# EasyEDA Pro project ProPrj_电容计量V2_2026-06-24.epro, schematic Schematic2_4
Board Name: Board2; Create Date: 2025-10-20; Page Name: P1; Project Name: 电容计量; Schematic Name: Schematic2; Update Date: 2025-11-02; Page Size: A4; Version: V1.0
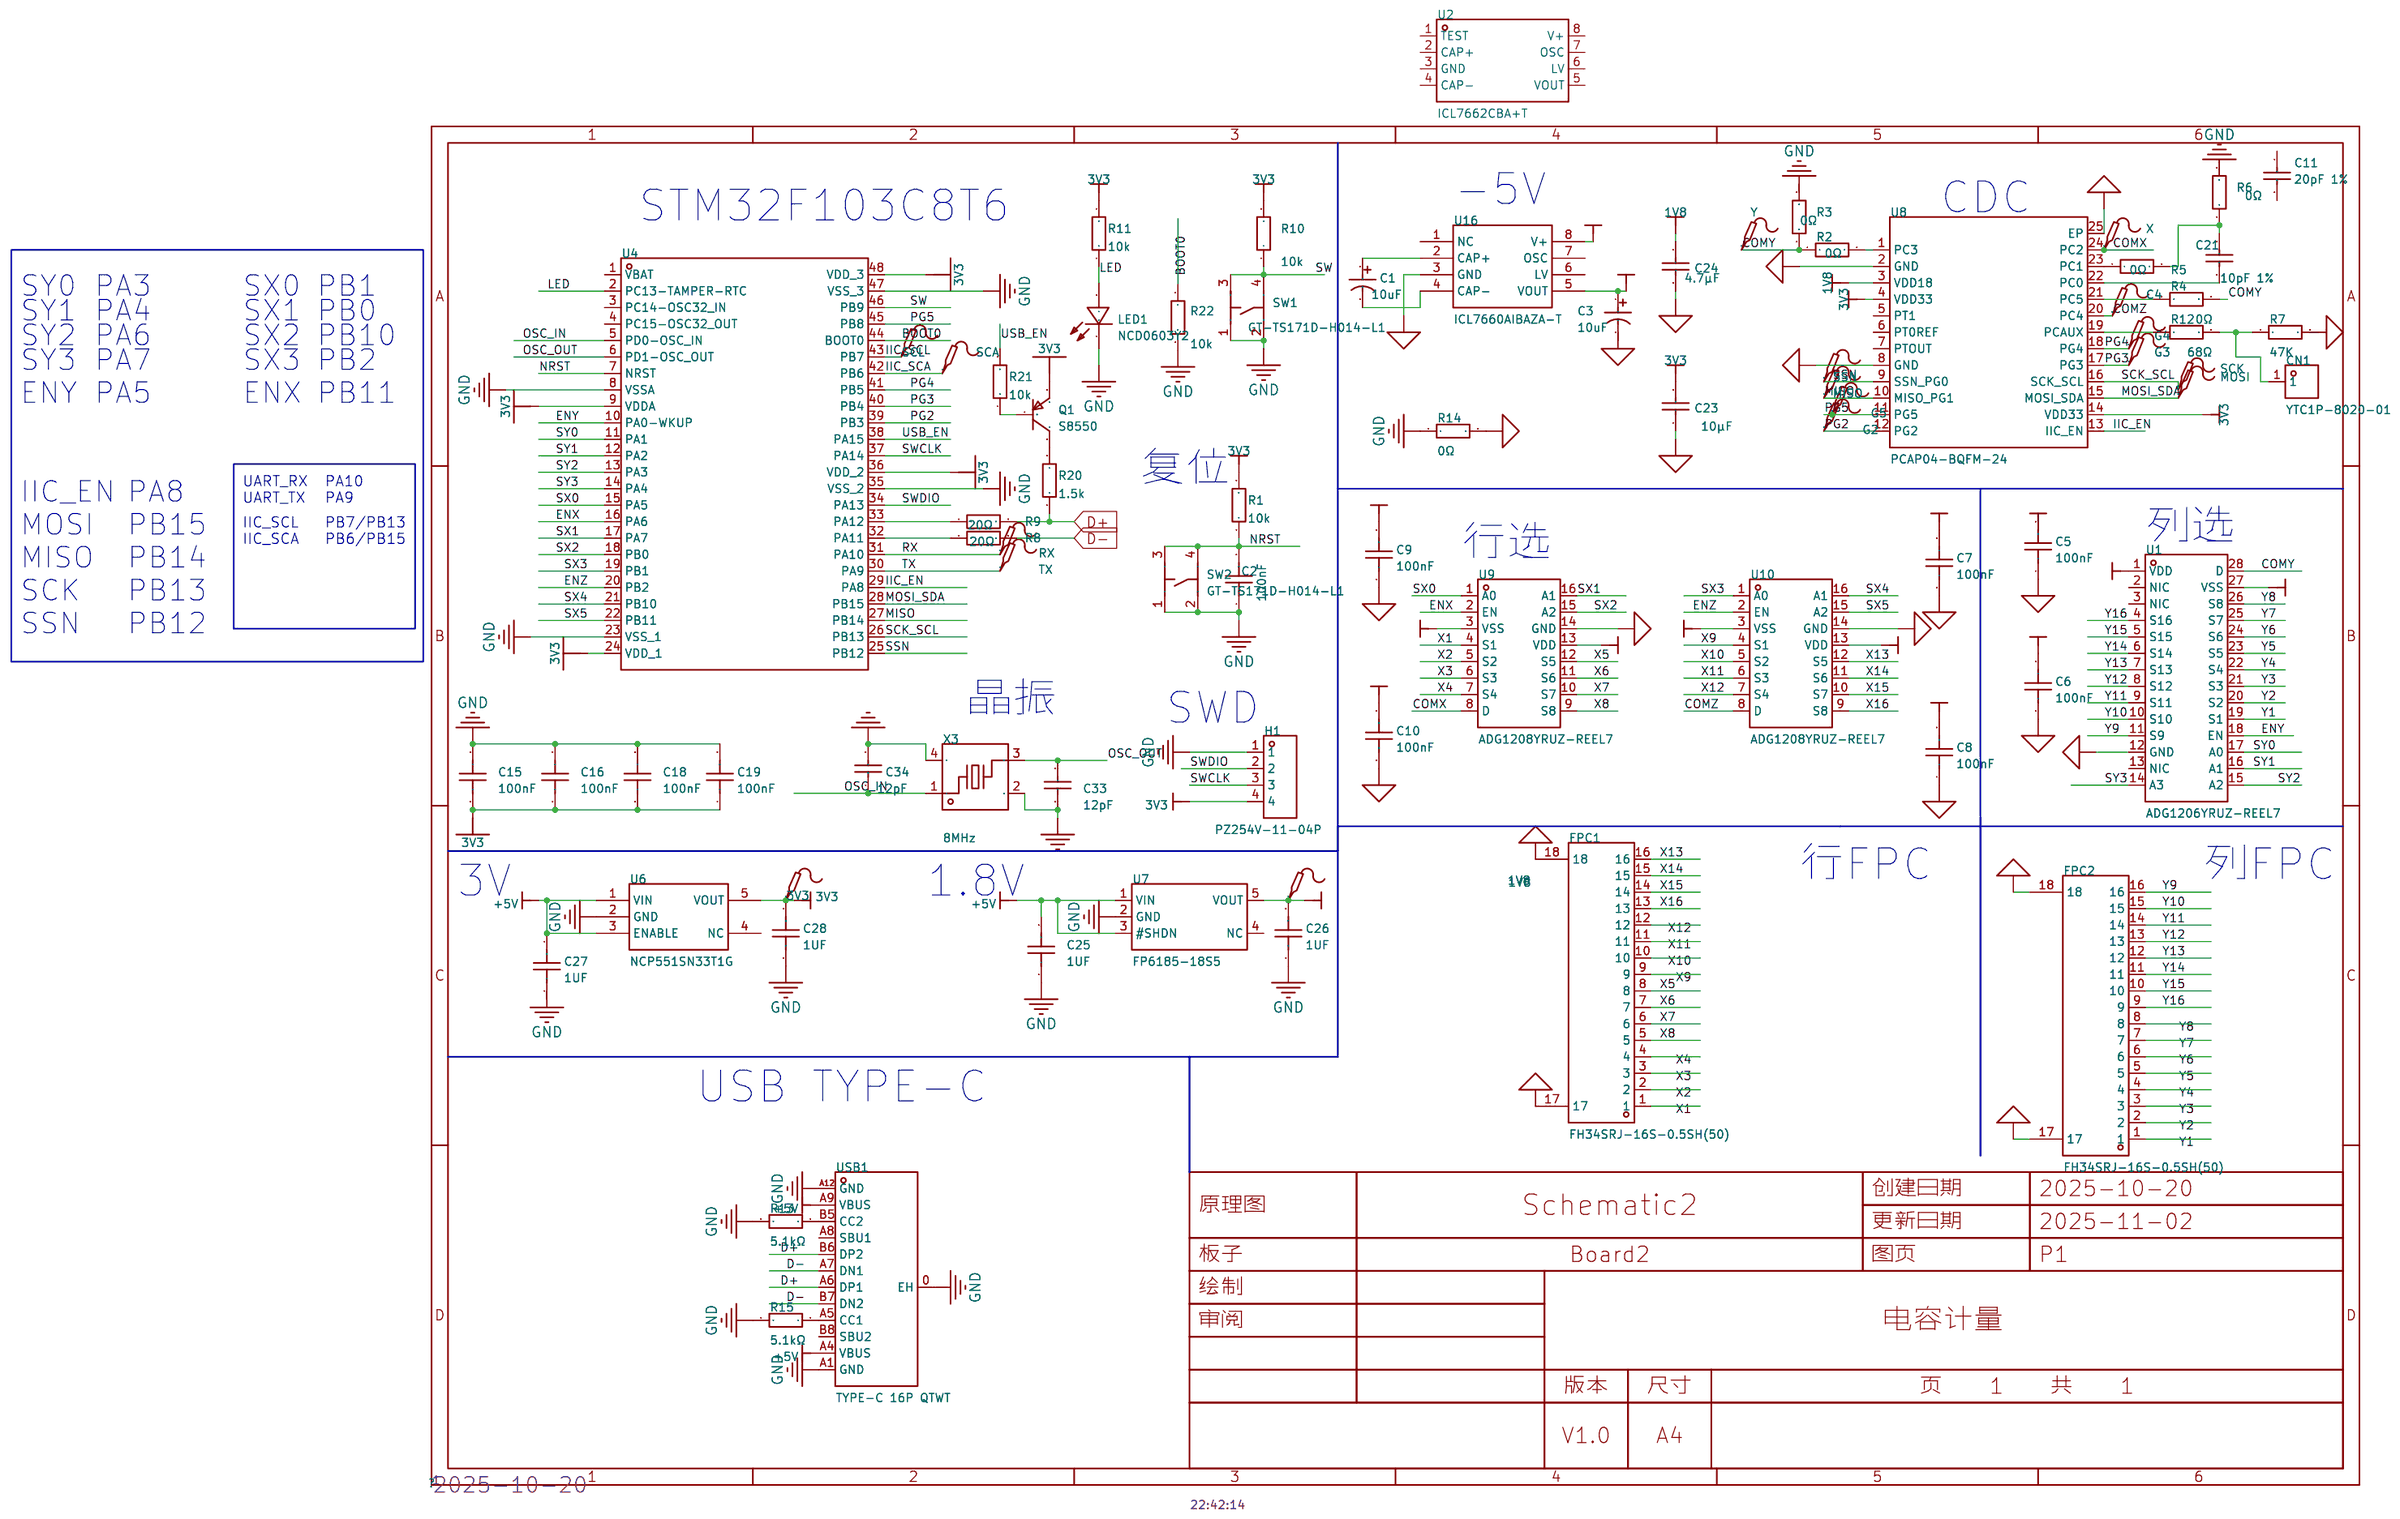
[diagram p9: schematic sheet]

## Parts
1V8  -  [Test-Point-0.5mm]
3V3  -  [Test-Point-0.5mm]
C1  10uF  [CASE-A_3216]
C2  100nF  [C0402]
C3  10uF  [CASE-A_3216]
C4  -  [Test-Point-0.5mm]
C5  100nF  [C0402]
C6  100nF  [C0402]
C7  100nF  [C0402]
C8  100nF  [C0402]
C9  100nF  [C0402]
C10  100nF  [C0402]
C11  20pF 1%  [C0402]
C15  100nF  [C0402]
C16  100nF  [C0402]
C18  100nF  [C0402]
C19  100nF  [C0402]
C21  10pF 1%  [C0402]
C23  10μF  [C0402]
C24  4.7μF  [C0402]
C25  1UF  [C0402]
C26  1UF  [C0402]
C27  1UF  [C0402]
C28  1UF  [C0402]
C33  12pF  [C0402]
C34  12pF  [C0402]
CN1  YTC1P-8020-01  [SMD-1_BD2.0-H10.0]
FPC1  FH34SRJ-16S-0.5SH(50)  [FFC-SMD_16P-P0.50_FH34SRJ-16S-0.5SH]
FPC2  FH34SRJ-16S-0.5SH(50)  [FFC-SMD_16P-P0.50_FH34SRJ-16S-0.5SH]
G2  -  [Test-Point-0.5mm]
G3  -  [Test-Point-0.5mm]
G4  -  [Test-Point-0.5mm]
G5  -  [Test-Point-0.5mm]
H1  PZ254V-11-04P  [HDR-TH_4P-P2.54-V-M]
LED1  NCD0603Y2  [LED0603-RD]
MISO  -  [Test-Point-0.5mm]
MOSI  -  [Test-Point-0.5mm]
Q1  S8550  [SOT-23-3_L2.9-W1.3-P1.90-LS2.4-BR]
R1  10k  [R0402]
R2  0Ω  [R0402]
R3  0Ω  [R0402]
R4  0Ω  [R0603]
R5  0Ω  [R0402]
R6  0Ω  [R0402]
R7  47K  [R0402]
R8  20Ω  [R0402]
R9  20Ω  [R0402]
R10  10k  [R0402]
R11  10k  [R0402]
R12  68Ω  [R0402]
R13  5.1kΩ  [R0402]
R14  0Ω  [R0402]
R15  5.1kΩ  [R0402]
R20  1.5k  [R0402]
R21  10k  [R0402]
R22  10k  [R0402]
RX  -  [Test-Point-0.5mm]
SCA  -  [Test-Point-0.5mm]
SCK  -  [Test-Point-0.5mm]
SCL  -  [Test-Point-0.5mm]
SSN  -  [Test-Point-0.5mm]
SW1  GT-TS171D-H014-L1  [SW-SMD_4P-L3.0-W2.8-P1.65-TL_GT-TS171A-H014-L1]
SW2  GT-TS171D-H014-L1  [SW-SMD_4P-L3.0-W2.8-P1.65-TL_GT-TS171A-H014-L1]
TX  -  [Test-Point-0.5mm]
U1  ADG1206YRUZ-REEL7  [TSSOP-28_L9.7-W4.4-P0.65-LS6.4-BL]
U2  ICL7662CBA+T  [SOIC-8_L4.9-W3.9-P1.27-LS6.0-BL]
U4  -  [LQFP-48_L7.0-W7.0-P0.50-LS9.0-BL]
U6  NCP551SN33T1G  [SOT-23-5_L3.0-W1.7-P0.95-LS2.8-BR]
U7  FP6185-18S5  [SOT-23-5_L3.0-W1.7-P0.95-LS2.8-BR]
U8  PCAP04-BQFM-24  [TQFN-24_L4.0-W4.0-P0.50-BL-EP2.6]
U9  ADG1208YRUZ-REEL7  [TSSOP-16_L5.0-W4.4-P0.65-LS6.4-BL]
U10  ADG1208YRUZ-REEL7  [TSSOP-16_L5.0-W4.4-P0.65-LS6.4-BL]
U16  ICL7660AIBAZA-T  [SOIC-8_L5.0-W4.0-P1.27-LS6.0-BL]
USB1  TYPE-C 16P QTWT  [USB-TYPE-C-SMD_TYPE-C-16P-QTWT]
X  -  [Test-Point-0.5mm]
X3  8MHz  [CRYSTAL-SMD_4P-L3.2-W2.5-BL-1]
Y  -  [Test-Point-0.5mm]

## Library data of the parts
1V8 3V3 C4 G2-G5 MISO MOSI RX SCA SCK SCL SSN TX X Y = Test-Point: Test Point 测试点
C1 C3 = CA45-A016K106T: 容值:10uF;精度:±10%;额定电压:16V;等效串联电阻(ESR):3Ω@100kHz;; LCSC Part Name: 10uF ±10% 16V; Supplier Part: C119051; Manufacturer: 湘怡中元/湘江; Supplier Footprint: CASE-A-3216-16(mm); JLCPCB Part Class: Extended Part; Datasheet: https://atta.szlcsc.com/upload/public/pdf/source/20191009/C435293_78A410F3D73489DBEAC46056C4262F7A.pdf; Supplier: LCSC; Tolerance: ±10%; Voltage Rating: 16V; Equivalent Series Resistance(ESR): 3Ω@100kHz; Operating Temperature: -55℃~+125℃
C2 = CC0603KRX7R9BB104: 容值:100nF;精度:±10%;额定电压:50V;材质(温度系数):X7R;; LCSC Part Name: 100nF ±10% 50V; Supplier Part: C14663; Manufacturer: YAGEO(国巨); Supplier Footprint: 0603; JLCPCB Part Class: Basic Part; Datasheet: https://atta.szlcsc.com/upload/public/pdf/source/20170116/1484561234239.pdf; Supplier: LCSC; Tolerance: ±10%; Voltage Rated: 50V; Temperature Coefficient: X7R
C5-C10 C15 C16 C18 C19 C25-C28 = CC0402KRX7R7BB104: 容值:100nF;精度:±10%;额定电压:16V;温度系数:X7R;; LCSC Part Name: 100nF ±10% 16V; Supplier Part: C60474; Manufacturer: YAGEO(国巨); Supplier Footprint: 0402; JLCPCB Part Class: Extended Part; Datasheet: https://atta.szlcsc.com/upload/public/pdf/source/20211223/9278FD768280B81DDBEF48FA36411A03.pdf; Supplier: LCSC; Tolerance: ±10%; Voltage Rated: 16V; Temperature Coefficient: X7R
C11 C21 C23 C24 = CC0603JRNPO9BN200: 容值:20pF;精度:±5%;额定电压:50V;温度系数:NP0;; LCSC Part Name: 20pF ±5% 50V; Supplier Part: C105621; Manufacturer: YAGEO(国巨); Supplier Footprint: 0603; JLCPCB Part Class: Extended Part; Datasheet: https://atta.szlcsc.com/upload/public/pdf/source/20170425/1493115771885.pdf; Supplier: LCSC; Tolerance: ±5%; Voltage Rated: 50V; Temperature Coefficient: NP0
C33 C34 = GCM1555C1H120FA16D: 容值:12pF;精度:±1%;额定电压:50V;材质(温度系数):C0G;; LCSC Part Name: 12pF ±1% 50V; Supplier Part: C393682; Manufacturer: muRata(村田); Supplier Footprint: 0402; JLCPCB Part Class: Extended Part; Datasheet: https://atta.szlcsc.com/upload/public/pdf/source/20190516/C393682_2405B7553F1D74F0F214F12B2CF6E34B.pdf; Supplier: LCSC; Tolerance: ±1%; Voltage Rated: 50V; Temperature Coefficient: C0G
CN1 = YTC1P-8020-01: 类型:弹簧顶针(POGO PIN);总PIN数:1P;全长/全高:10mm;额定电流:2.5A;额定电压:12V;触头材质:黄铜;触头镀层:金;; LCSC Part Name: POGO PIN弹簧顶针 贴片连接器; Supplier Part: C5221286; Manufacturer: YIYUAN(怡远); Supplier Footprint: SMD,D=2mm; JLCPCB Part Class: Extended Part; Datasheet: https://item.szlcsc.com/datasheet/YTC1P-8020-01/5919200.html; Supplier: LCSC; Type: 弹簧顶针(POGO PIN); Number of Pins: 1P; Overall Length/Height: 10mm; Current Rating: 2.5A; Voltage Rating: 12V; Contact Material: 黄铜; Contact Plating: 金
FPC1 FPC2 = FH34SRJ-16S-0.5SH(50): 锁定特性:-;触点类型:双侧触点/上下接;触点数量:16P;间距:0.5mm;安装方式:卧贴;工作温度:-55℃~+105℃;; LCSC Part Name: 间距:0.5mm P数:16P 双侧触点/上下接; Supplier Part: C324725; Manufacturer: HRS(广濑); Supplier Footprint: SMD,P=0.5mm,卧贴; JLCPCB Part Class: 扩展库; Datasheet: https://item.szlcsc.com/datasheet/FH34SRJ-16S-0.5SH(50)/305535.html; Supplier: LCSC; Contact Type: 双侧触点/上下接; Number of Contacts: 16P; Pitch: 0.5mm; Mounting Type: 卧贴; FFC, FCB Thickness: 0.3mm; Height Above Board: 1mm; Contact Material: 磷青铜; Contact Plating: 金; Operating Temperature: -55℃~+105℃
H1 = PZ254V-11-04P: 插针结构:1x4P;间距:2.54mm;行距:-;圆针/方针:方针;安装方式:直插;排数:单排;总PIN位数:4P;额定电流:3A;额定电压:250V;配合针长度:6mm;塑高:2.5mm;端接针长度:3mm;触头材质:-;工作温度:-40℃~+105℃;颜色:黑色;; LCSC Part Name: 1x4P 间距:2.54mm 方针 直插; Supplier Part: C2691448; Manufacturer: XFCN(兴飞); Supplier Footprint: 插件,P=2.54mm; JLCPCB Part Class: 扩展库; Datasheet: https://item.szlcsc.com/datasheet/PZ254V-11-04P/2801085.html; Supplier: LCSC; Pin Structure: 1x4P; Pitch: 2.54mm; Circluar Pins/Square Pins: 方针; Mounting Type: 直插; Number of Rows: 单排; Number of Pins: 4P; Current Rating: 3A; Voltage Rating (Max): 250V; Length of Mating Pin: 6mm; Insulation Height: 2.5mm; Length of End Connection Pin: 3mm; Operating Temperature: -40℃~+105℃; Color: 黑色
LED1 = NCD0603Y2: 发光颜色:黄色;正向电压(VF):1.6V~2.6V;功率:65mW;正向电流:20mA;主波长:586nm~595nm;透镜颜色:无色透明透镜;发光强度:100mcd~220mcd;发光角度:130°;工作温度:-30℃~+85℃;; Supplier Part: C89811; Manufacturer: 国星光电; Supplier Footprint: 0603; JLCPCB Part Class: Extended Part; Datasheet: https://atta.szlcsc.com/upload/public/pdf/source/20200820/C89811_7FE84B429B6BCA3E113B125EE1452576.pdf; Supplier: LCSC; Emitted Color: 黄色; Forward Voltage (VF): 1.6V~2.6V; Power Dissipation: 65mW; Forward Current: 20mA; Dominant Wavelength: 586nm~595nm; Lens Color: 无色透明透镜; Luminous Intensity: 100mcd~220mcd; Viewing Angle: 130°; Operating Temperature: -30℃~+85℃
Q1 = S8550: LCSC Part Name: PNP -25V -500mA 120-400 SOT-23; Supplier Part: C2931720; Manufacturer: Doeshare(德芯); Supplier Footprint: SOT-23; JLCPCB Part Class: 扩展库; Datasheet: https://atta.szlcsc.com/upload/public/pdf/source/20220104/15A23F6542E365B9E2BA018BE45092B6.pdf; Supplier: LCSC
R1 R10 R11 R20-R22 = 0603WAF1002T5E: LCSC Part Name: 10KΩ(1002) ±1% 编带; Supplier Part: C25804; Manufacturer: UNI-ROYAL(厚声); Supplier Footprint: 0603; JLCPCB Part Class: Basic Part; Datasheet: https://atta.szlcsc.com/upload/public/pdf/source/20170920/C25804_1505901551523983377.pdf; Supplier: LCSC
R2-R7 R12 R14 = 0402WGF0000TCE: 电阻类型:厚膜电阻;阻值:0Ω;精度:±1%;功率:62.5mW;工作电压:50V;温度系数:±800ppm/℃;; LCSC Part Name: 0Ω ±1% 62.5mW 厚膜电阻; Supplier Part: C17168; Manufacturer: UNI-ROYAL(厚声); Supplier Footprint: 0402; JLCPCB Part Class: Basic Part; Datasheet: https://item.szlcsc.com/datasheet/0402WGF0000TCE/17853.html; Supplier: LCSC; Type: 厚膜电阻; Tolerance: ±1%; Power(Watts): 62.5mW; Voltage-Supply(Max): 50V; Temperature Coefficient: ±800ppm/℃; Operating Temperature: -55℃~+155℃
R8 R9 = 0402WGJ0102TCE: 电阻类型:厚膜电阻;阻值:1kΩ;精度:±5%;功率:1/16W;温度系数:±100ppm/℃;最大工作电压:50V;工作温度范围:-55℃~+155℃;; LCSC Part Name: 1kΩ ±5%; Supplier Part: C25543; Manufacturer: UNI-ROYAL(厚声); Supplier Footprint: 0402; JLCPCB Part Class: Extended Part; Datasheet: https://atta.szlcsc.com/upload/public/pdf/source/20200306/C422600_1E6D84923E4A46A82E41ADD87F860B5C.pdf; Supplier: LCSC; Type: 厚膜电阻; Tolerance: ±5%; Power(Watts): 1/16W; Temperature Coefficient: ±100ppm/℃; Overload Voltage (Max): 50V; Operating Temperature Range: -55℃~+155℃
R13 R15 = 0805W8F5101T5E: 精度:±1%;温度系数:±100ppm/;阻值:5.1kΩ;功率:1/8W;最大工作电压:150V;工作温度范围:-55~+155;; LCSC Part Name: 5.1kΩ ±1%; Supplier Part: C27834; Manufacturer: UNI-ROYAL(厚声); Supplier Footprint: 0805; JLCPCB Part Class: 基础库; Datasheet: https://atta.szlcsc.com/upload/public/pdf/source/20170920/C27834_1505895234018981184.pdf; Supplier: LCSC; Tolerance: ±1%; Temperature Coefficient: ±100ppm/; Power(Watts): 1/8W; Overload Voltage (Max): 150V; Operating Temperature Range: -55~+155
SW1 SW2 = GT-TS171D-H014-L1: 电路结构:单刀单掷;按钮形状:圆形按钮;作用力:80gf;安装方式:立贴;开关长度:3mm;开关宽度:2.75mm;开关高度:1.4mm;带支架:不带支架;触点电流:50mA;额定电压:12V;带灯:无;工作寿命:10万次;; LCSC Part Name: 3*2.75*1.4mm 立贴 轻触开关; Supplier Part: C2762969; Manufacturer: G-Switch(品赞); Supplier Footprint: SMD; JLCPCB Part Class: Extended Part; Datasheet: https://item.szlcsc.com/datasheet/GT-TS171D-H014-L1/2892001.html; Supplier: LCSC; Circuit: 单刀单掷; Actuator Style: 圆形按钮; Operating Force: 80gf; Mounting Type: 立贴; Length: 3mm; Width: 2.75mm; Switch Height: 1.4mm; with Bracket: 不带支架; Contact Current: 50mA; Voltage Rating: 12V; Actuator/Cap Color: 白色; With Lamp: 无; Termination Style: SMD接片; Life: 10万次; Operating Temperature: -30℃~+85℃
U1 = ADG1206YRUZ-REEL7: 低电容、16通道、±15V/12ViCMOS多路复用器; LCSC Part Name: 低电容，16通道和8通道，±15 V/+12 V iCMOS多路复用器; Supplier Part: C578998; Manufacturer: ADI(亚德诺); Supplier Footprint: TSSOP-28; JLCPCB Part Class: Extended Part; Datasheet: https://atta.szlcsc.com/upload/public/pdf/source/20210202/C578998_D5EB99C91E084744101A87F9E00BE79C.pdf; Supplier: LCSC
U2 = ICL7662CBA+T: CMOS、电压变换器、无电感反向器; LCSC Part Name: CMOS电压变换器; Supplier Part: C242528; Manufacturer: ADI(亚德诺)/MAXIM(美信); Supplier Footprint: SOIC-8; JLCPCB Part Class: Extended Part; Datasheet: https://item.szlcsc.com/datasheet/ICL7662CBA%252BT/241355.html; Supplier: LCSC
U4 = STM32F103C8T6: 工作电压:2V ~ 3.6V;CPU位数:32-Bit;CPU内核:ARM® Cortex®-M3;主频（MAX):72MHz;ROM类型:FLASH;; Supplier Part: C8734; Manufacturer: ST(意法半导体); Supplier Footprint: LQFP-48_7x7x05P; JLCPCB Part Class: Basic Part; Datasheet: https://atta.szlcsc.com/upload/public/pdf/source/20140724/1457707174202.pdf; Supplier: LCSC
U6 = NCP551SN33T1G: 输出类型:固定;最大输入电压:12V;输出电压:3.3V;最大输出电流:150mA;电源纹波抑制比(PSRR):-;输出极性:正极;; LCSC Part Name: 输入12V 输出3.3V 150mA; Supplier Part: C58434; Manufacturer: onsemi(安森美); Supplier Footprint: TSOP-5; JLCPCB Part Class: 扩展库; Datasheet: https://atta.szlcsc.com/upload/public/pdf/source/20150917/1457707389016.pdf; Supplier: LCSC; Output Type: 固定; Maximum Input Voltage: 12V; Output Voltage: 3.3V; MAX Output Current: 150mA; Dropout Voltage: 150mV@(10mA); standby current: 8uA; Operating Temperature: -40℃~+85℃; Output Polarity: 正极; Number of Outputs: 1
U7 = FP6185-18S5: 输出类型:固定;工作电压:5.5V;输出电压:1.8V;输出电流:300mA;电源纹波抑制比(PSRR):75dB@(1kHz);输出极性:正极;; LCSC Part Name: 输入5V 输出1.8V 300mA; Supplier Part: C516195; Manufacturer: FITIPOWER(天钰); Supplier Footprint: SOT-23-5; JLCPCB Part Class: 扩展库; Datasheet: https://atta.szlcsc.com/upload/public/pdf/source/20200417/C516195_126B2E0F75342F37C6D4FF376B409168.pdf; Supplier: LCSC; Output Type: 固定; Voltage - Supply: 5.5V; Output Voltage: 1.8V; Output Current: 300mA; Power Supply Rejection Ratio (PSRR): 75dB@(1kHz); Voltage Dropout: 1.1V@(300mA); standby current: 35uA; Noise: 65uVrms; Features: 过热保护；过流保护; Operating Temperature: -40℃~+85℃@(Ta); Output Configuration: 正极; Number of Outputs: 1
U8 = PCAP04-BQFM-24: Supplier Part: C19083638; Manufacturer: Sciosense; Supplier Footprint: QFN-24(4x4); JLCPCB Part Class: 扩展库; Datasheet: https://atta.szlcsc.com/upload/public/pdf/source/20241016/5397125DBAB3894191847B275A5B5A75.pdf; Supplier: LCSC
U9 U10 = ADG1208YRUZ-REEL7: 低电容、8通道、±15V/+12ViCMOS多路复用器; LCSC Part Name: 低电容，4/8通道，±15 V/+12 V iCMOS多路复用器; Supplier Part: C391266; Manufacturer: ADI(亚德诺); Supplier Footprint: TSSOP-16; JLCPCB Part Class: Extended Part; Datasheet: https://item.szlcsc.com/datasheet/ADG1208YRUZ-REEL7/368489.html; Supplier: LCSC
U16 = ICL7660AIBAZA-T: ICL7660S和ICL7660A超级电压转换器是单片CMOS电压转换集成电路，与其他类似器件相比，具有显著的性能优势。; LCSC Part Name: 超电压转换器; Supplier Part: C7881; Manufacturer: RENESAS(瑞萨)/IDT; Supplier Footprint: SOIC-8; JLCPCB Part Class: Extended Part; Datasheet: https://item.szlcsc.com/datasheet/ICL7660AIBAZA-T/8358.html; Supplier: LCSC; Operating Voltage: 1.5V~12V; Quiescent Current: 100uA; Output Resistance: 97Ω; Energy Efficiency: 98%; Switching Frequency: 8kHz; Operating Temperature: -40℃~+85℃; Function: 反相; Output Voltage: -12V~-1.5V
USB1 = TYPE-C 16P QTWT: 连接器类型:Type-C;协议标准:USB 3.1;公母:母;安装方式:卧贴;触点数量:16P;端口数量:1;额定电流 - 电源:3A;工作温度:-25℃~+85℃;; LCSC Part Name: Type-C 母 卧贴; Supplier Part: C5187472; Manufacturer: SHOU HAN(首韩); Supplier Footprint: SMD; JLCPCB Part Class: Extended Part; Datasheet: https://item.szlcsc.com/datasheet/TYPE-C%252016P%2520QTWT/5860367.html; Supplier: LCSC; Connector Type: Type-C; Protocol Standard: USB 3.1; Gender: 母; Mounting Type: 卧贴; Number of Contacts: 16P; Number of Ports: 1; Current Rating-Power: 3A; Voltage Rating: 5V; Connect-Disconnect Life: 5千次; Detection color: 黑色; Operating Temperature: -25℃~+85℃
X3 = XL2EL89COI-111YLC-8M: 晶振类型:贴片晶振;频率:8MHz;常温频差:±10ppm;外接负载电容:12pF;频率稳定度(全温):±20ppm;; LCSC Part Name: 8MHz ±10ppm 12pF; Supplier Part: C2973805; Manufacturer: YXC(扬兴晶振); Supplier Footprint: SMD3225-4P; JLCPCB Part Class: 扩展库; Datasheet: https://atta.szlcsc.com/upload/public/pdf/source/20240329/19D5F850207469550BEB00D7DFEDBC7A.pdf; Supplier: LCSC; Crystal Type: 贴片晶振; Normal temperature Frequency Tolerance: ±10ppm; External load capacitor: 12pF; Frequency Stability(Full temperature range): ±20ppm; Equivalent Series Resistance (ESR): 150Ω; Operating Temperature: -40℃~+85℃

## Nets
1V8: 1V8.1 C24.2 C26.2 U7.5(VOUT) U8.3(VDD18)
3V3: 3V3.1 C15.1 C16.1 C18.1 C19.1 C23.2 C28.2 H1.4 Q1.2(E) R1.2 R10.2 R11.2 U4.9(VDDA) U4.24(VDD_1) U4.36(VDD_2) U4.48(VDD_3) U6.5(VOUT) U8.4(VDD33) U8.14(VDD33)
+5V: C5.2 C8.2 C9.2 C25.2 C27.2 U1.1(VDD) U6.1(VIN) U6.3(ENABLE) U7.1(VIN) U7.3(#SHDN) U9.13(VDD) U10.13(VDD) U16.8(V+) USB1.A4(VBUS) USB1.A9(VBUS)
-5V: C3.1 C6.2 C7.2 C10.2 U1.27(VSS) U9.3(VSS) U10.3(VSS) U16.5(VOUT)
AGND: C3.2 C5.1 C6.1 C7.1 C8.1 C9.1 C10.1 C23.1 C24.1 FPC1.17 FPC1.18 FPC2.17 FPC2.18 R7.2 R14.2 U1.12(GND) U8.2(GND) U8.8(GND) U8.25(EP) U9.14(GND) U10.14(GND) U16.3(GND)
GND: C2.1 C15.2 C16.2 C18.2 C19.2 C25.1 C26.1 C27.1 C28.1 C33.1 C34.2 H1.1 LED1.1(K) R3.2 R6.2 R13.2 R14.1 R15.2 R22.1 SW1.1 SW1.2 SW2.1 SW2.2 U4.8(VSSA) U4.23(VSS_1) U4.35(VSS_2) U4.47(VSS_3) U6.2(GND) U7.2(GND) USB1.0(EH) USB1.A1(GND) USB1.A12(GND) X3.2(GND) X3.4(GND)
BOOT0: R22.2 U4.44(BOOT0)
COMX: U8.24(PC2) U9.8(D) X.1
COMY: R2.1 R3.1 R4.2 U1.28(D) Y.1
COMZ: C4.1 U8.20(PC4) U10.8(D)
D+: R9.2 R20.1 USB1.A6(DP1) USB1.B6(DP2)
D-: R8.2 USB1.A7(DN1) USB1.B7(DN2)
ENX: U4.16(PA6) U9.2(EN)
ENY: U1.18(EN) U4.10(PA0-WKUP)
ENZ: U4.20(PB2) U10.2(EN)
IIC_EN: U4.29(PA8) U8.13(IIC_EN)
IIC_SCA: SCA.1 U4.42(PB6)
IIC_SCL: SCL.1 U4.43(PB7)
LED: LED1.2(A) R11.1 U4.2(PC13-TAMPER-RTC)
MISO: MISO.1 U4.27(PB14) U8.10(MISO_PG1)
MOSI_SDA: MOSI.1 U4.28(PB15) U8.15(MOSI_SDA)
NRST: C2.2 R1.1 SW2.3 SW2.4 U4.7(NRST)
OSC_IN: C34.1 U4.5(PD0-OSC_IN) X3.1
OSC_OUT: C33.2 U4.6(PD1-OSC_OUT) X3.3
PG2: G2.1 U4.39(PB3) U8.12(PG2)
PG3: G3.1 U4.40(PB4) U8.17(PG3)
PG4: G4.1 U4.41(PB5) U8.18(PG4)
PG5: G5.1 U4.45(PB8) U8.11(PG5)
RX: RX.1 U4.31(PA10)
SCK_SCL: SCK.1 U4.26(PB13) U8.16(SCK_SCL)
SSN: SSN.1 U4.25(PB12) U8.9(SSN_PG0)
SW: R10.1 SW1.3 SW1.4 U4.46(PB9)
SWCLK: H1.3 U4.37(PA14)
SWDIO: H1.2 U4.34(PA13)
SX0: U4.15(PA5) U9.1(A0)
SX1: U4.17(PA7) U9.16(A1)
SX2: U4.18(PB0) U9.15(A2)
SX3: U4.19(PB1) U10.1(A0)
SX4: U4.21(PB10) U10.16(A1)
SX5: U4.22(PB11) U10.15(A2)
SY0: U1.17(A0) U4.11(PA1)
SY1: U1.16(A1) U4.12(PA2)
SY2: U1.15(A2) U4.13(PA3)
SY3: U1.14(A3) U4.14(PA4)
TX: TX.1 U4.30(PA9)
USB_EN: R21.2 U4.38(PA15)
X1: FPC1.1 U9.4(S1)
X2: FPC1.2 U9.5(S2)
X3: FPC1.3 U9.6(S3)
X4: FPC1.4 U9.7(S4)
X5: FPC1.8 U9.12(S5)
X6: FPC1.7 U9.11(S6)
X7: FPC1.6 U9.10(S7)
X8: FPC1.5 U9.9(S8)
X9: FPC1.9 U10.4(S1)
X10: FPC1.10 U10.5(S2)
X11: FPC1.11 U10.6(S3)
X12: FPC1.12 U10.7(S4)
X13: FPC1.16 U10.12(S5)
X14: FPC1.15 U10.11(S6)
X15: FPC1.14 U10.10(S7)
X16: FPC1.13 U10.9(S8)
Y1: FPC2.1 U1.19(S1)
Y2: FPC2.2 U1.20(S2)
Y3: FPC2.3 U1.21(S3)
Y4: FPC2.4 U1.22(S4)
Y5: FPC2.5 U1.23(S5)
Y6: FPC2.6 U1.24(S6)
Y7: FPC2.7 U1.25(S7)
Y8: FPC2.8 U1.26(S8)
Y9: FPC2.16 U1.11(S9)
Y10: FPC2.15 U1.10(S10)
Y11: FPC2.14 U1.9(S11)
Y12: FPC2.13 U1.8(S12)
Y13: FPC2.12 U1.7(S13)
Y14: FPC2.11 U1.6(S14)
Y15: FPC2.10 U1.5(S15)
Y16: FPC2.9 U1.4(S16)
$1N2750: R8.1 U4.32(PA11)
$1N2822: R9.1 U4.33(PA12)
$1N7830: Q1.3(C) R20.2
$1N7914: Q1.1(B) R21.1
$1N10049: C21.2 U8.22(PC0)
$1N22374: C1.1 U16.2(CAP+)
$1N22375: C1.2 U16.4(CAP-)
$1N22395: R2.2 U8.1(PC3)
$1N22399: R4.1 U8.21(PC5)
$1N22400: C21.1 R5.2 R6.1
$1N22402: R5.1 U8.23(PC1)
$1N22433: R13.1 USB1.B5(CC2)
$1N22435: R15.1 USB1.A5(CC1)
$1N22518: R12.1 U8.19(PCAUX)
$1N22519: CN1.1 R7.1 R12.2

Not connected (* = marked no-connect by the designer): C11 1 2; U1 2(NIC) 3(NIC) 13(NIC); U2 1(TEST) 2(CAP+) 3(GND) 4(CAP-) 5(VOUT) 6(LV) 7(OSC) 8(V+); U4 1(VBAT) 3(PC14-OSC32_IN) 4(PC15-OSC32_OUT); U6 4(NC); U7 4(NC); U8 5(PT1) 6(PT0REF) 7(PTOUT); U16 1(NC) 6(LV) 7(OSC); USB1 A8(SBU1) B8(SBU2)

## Notes on the sheet
- -5V
- CDC
- STM32F103C8T6
- SY0
- PA3
- SX0
- PB1
- SY1
- PA4
- SX1
- PB0
- SY2
- PA6
- SX2
- PB10
- SY3
- PA7
- SX3
- PB2
- ENY
- PA5
- ENX
- PB11
- UART_RX
- PA10
- 复位
- IIC_EN
- PA8
- UART_TX
- PA9
- IIC_SCL
- PB7/PB13
- MOSI
- PB15
- IIC_SCA
- PB6/PB15
- 列选
- MISO
- PB14
- 行选
- SCK
- PB13
- SSN
- PB12
- 晶振
- SWD
- 行FPC
- 列FPC
- 3V
- 1.8V
- USB TYPE-C
